# EAGLE design avr-net-pcb-rev.B (EAGLE 5.10)
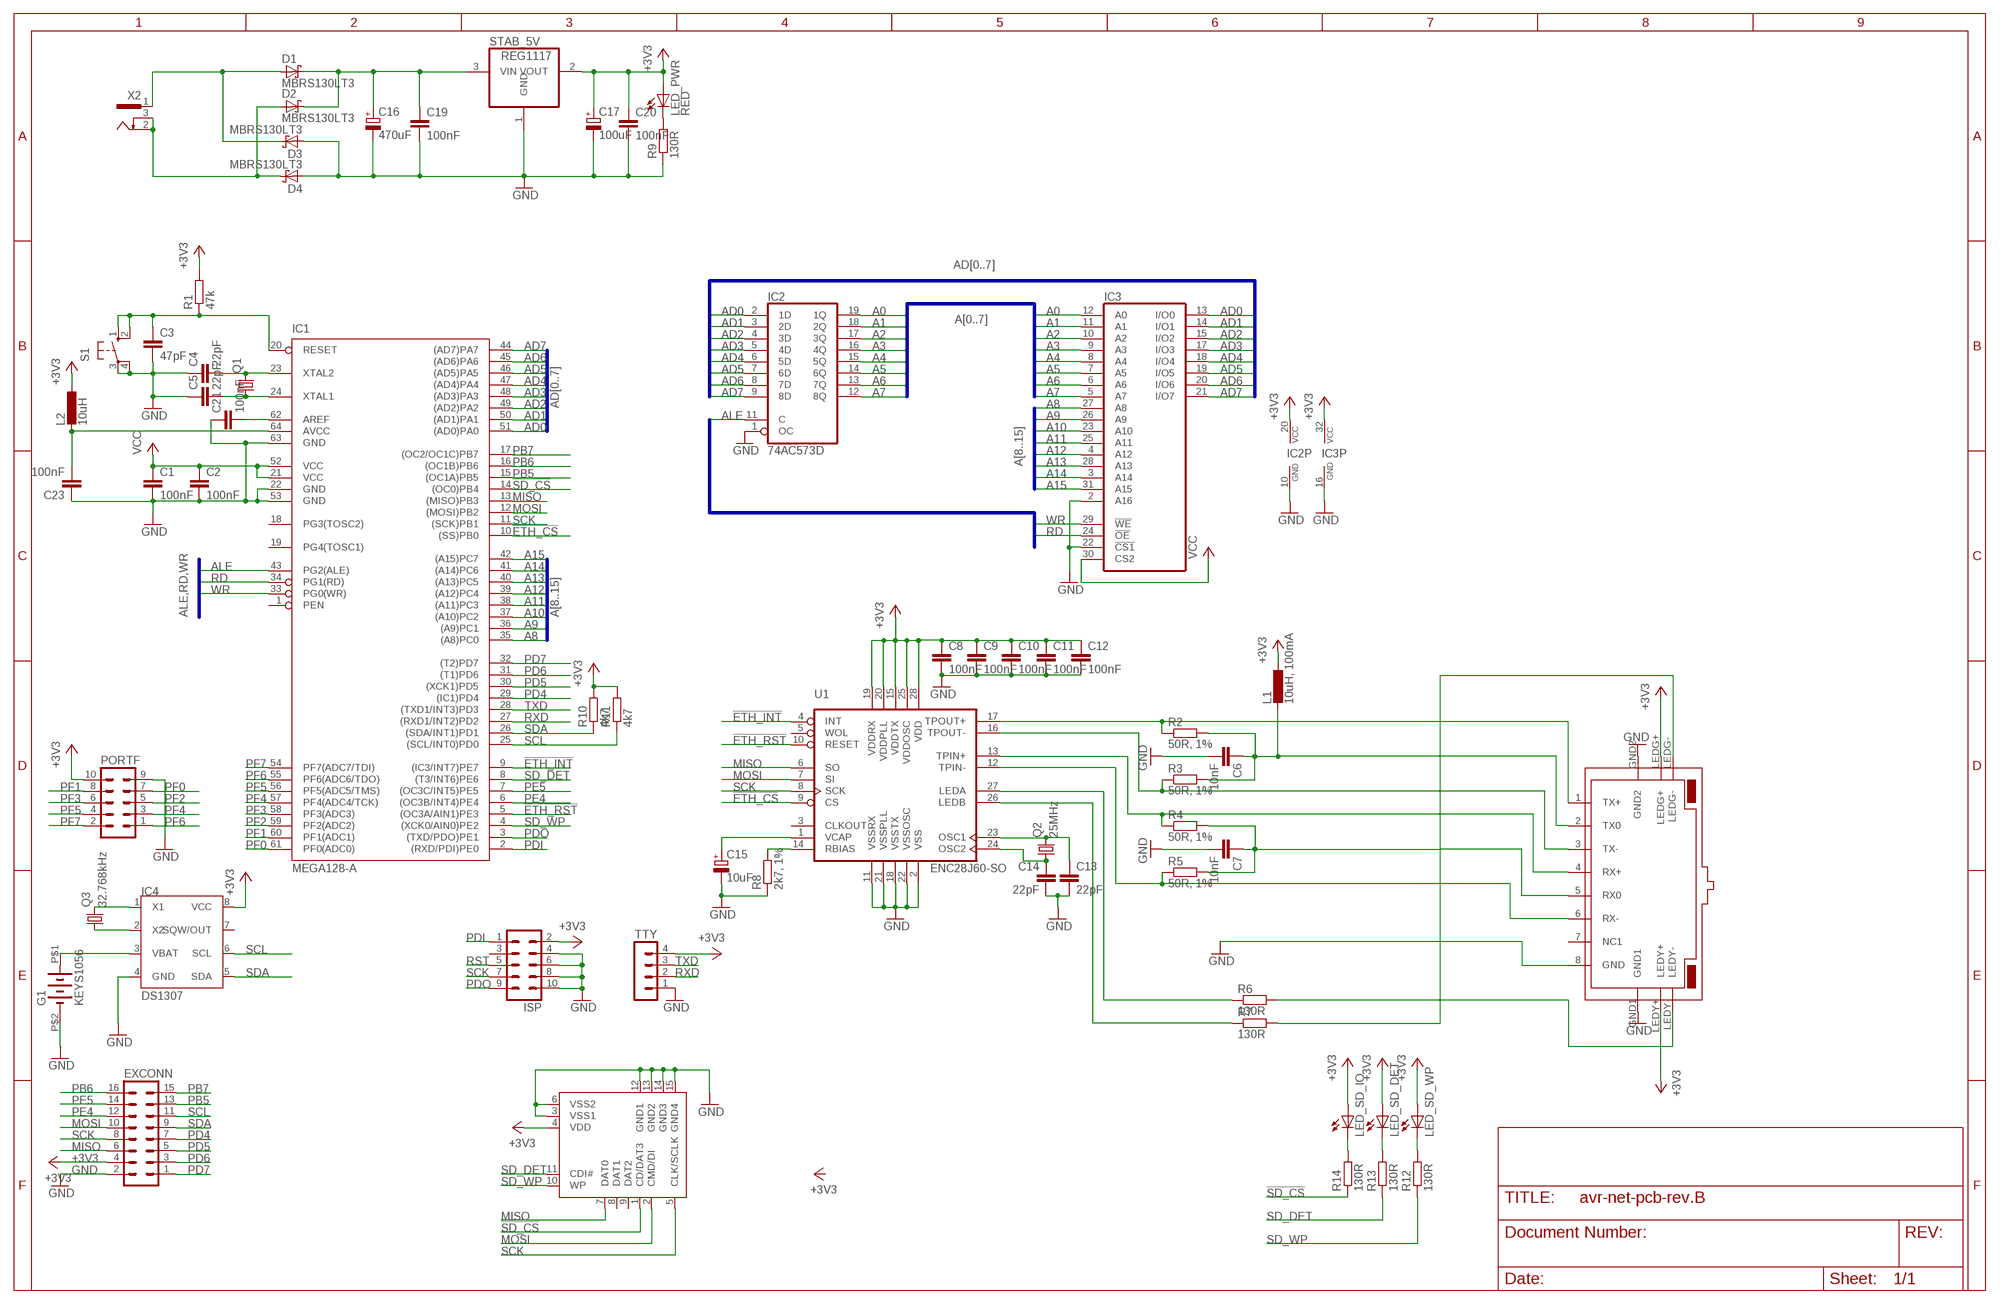
[diagram p0: schematic, sheet 1]

## Parts
C1  100nF  C-EUC0805  [C0805]
C2  100nF  C-EUC0805  [C0805]
C3  47pF  C-EUC0805  [C0805]
C4  22pF  C-EUC0805  [C0805]
C5  22pF  C-EUC0805  [C0805]
C6  10nF  C-EUC0805  [C0805]
C7  10nF  C-EUC0805  [C0805]
C8  100nF  C-EUC0805  [C0805]
C9  100nF  C-EUC0805  [C0805]
C10  100nF  C-EUC0805  [C0805]
C11  100nF  C-EUC0805  [C0805]
C12  100nF  C-EUC0805  [C0805]
C13  22pF  C-EUC0805  [C0805]
C14  22pF  C-EUC0805  [C0805]
C15  10uF  CPOL-EU153CLV-0505  [153CLV-0505]
C16  470uF  CPOL-EU153CLV-0810  [153CLV-0810]
C17  100uF  CPOL-EU153CLV-0810  [153CLV-0810]
C19  100nF  C-EUC0805  [C0805]
C20  100nF  C-EUC0805  [C0805]
C21  100nF  C-EUC0805  [C0805]
C23  100nF  C-EUC0805  [C0805]
D1  MBRS130LT3  [SMB]
D2  MBRS130LT3  [SMB]
D3  MBRS130LT3  [SMB]
D4  MBRS130LT3  [SMB]
EXCONN  MA08-2  [MA08-2]
G1  KEYS1056  [CR1220]
IC1  MEGA128-A  [TQFP64]
IC2  74AC573D  [SO20W]
IC3  LP621024CM  [SOP32L]
IC4  DS1307  [SOIC-8]
ISP  ML10  [ML10]
L1  10uH, 100mA  L-EUL1210W  [L1210W]
L2  10uH  L-EUL1210W  [L1210W]
LED_PWR  RED  LEDCHIPLED_1206  [CHIPLED_1206]
LED_SD_DET  LEDCHIPLED_1206  [CHIPLED_1206]
LED_SD_IO  LEDCHIPLED_1206  [CHIPLED_1206]
LED_SD_WP  LEDCHIPLED_1206  [CHIPLED_1206]
PORTF  MA05-2  [MA05-2]
Q1  CRYSTALHC49UP  [HC49UP]
Q2  25MHz  CRYSTALHC49UP  [HC49UP]
Q3  32.768kHz  91SMX  [91SMX]
R1  47k  R-EU_R0805  [R0805]
R2  50R, 1%  R-EU_R0805  [R0805]
R3  50R, 1%  R-EU_R0805  [R0805]
R4  50R, 1%  R-EU_R0805  [R0805]
R5  50R, 1%  R-EU_R0805  [R0805]
R6  130R  R-EU_R0805  [R0805]
R7  130R  R-EU_R0805  [R0805]
R8  2k7, 1%  R-EU_M0805  [M0805]
R9  130R  R-EU_R0805  [R0805]
R10  4k7  R-EU_R0805  [R0805]
R11  4k7  R-EU_R0805  [R0805]
R12  130R  R-EU_R0805  [R0805]
R13  130R  R-EU_R0805  [R0805]
R14  130R  R-EU_R0805  [R0805]
S1  10-XX  [B3F-10XX]
STAB_5V  REG1117  [SOT223]
TTY  MA04-1  [MA04-1]
U1  ENC28J60-SO  [SO28W]
U$1  RJ45-TRAFO-L  [RJ45-TRAFO-L]
U$2  SDCARDVAR2  [SDCMF-10915W010]
X2  SCD-014A  [SCD-014-A]

## Nets
!ETH_CS: IC1.10((SS)PB0) U1.9(CS)
!ETH_INT: IC1.9((IC3/INT7)PE7) U1.4(INT)
!ETH_RST: IC1.5((OC3A/AIN1)PE3) U1.10(RESET)
!SD_CS: IC1.14((OC0)PB4) R14.1 U$2.1(CD/DAT3)
+3V3: C1.1 C2.1 C8.1 C9.1 C10.1 C11.1 C12.1 C17.+ C20.1 EXCONN.4 IC1.21(VCC) IC1.52(VCC) IC2.20(VCC) IC3.30(CS2) IC3.32(VCC) IC4.8(VCC) ISP.2 L1.1 L2.1 LED_PWR.A LED_SD_DET.A LED_SD_IO.A LED_SD_WP.A PORTF.10 R1.2 R10.2 R11.2 STAB_5V.2(VOUT) TTY.4 U1.15(VDDTX) U1.19(VDDRX) U1.20(VDDPLL) U1.25(VDDOSC) U1.28(VDD) U$1.LEDG+ U$1.LEDY+ U$2.4(VDD) ; supply symbol labelled VCC
A0: IC2.19(1Q) IC3.12(A0)
A1: IC2.18(2Q) IC3.11(A1)
A2: IC2.17(3Q) IC3.10(A2)
A3: IC2.16(4Q) IC3.9(A3)
A4: IC2.15(5Q) IC3.8(A4)
A5: IC2.14(6Q) IC3.7(A5)
A6: IC2.13(7Q) IC3.6(A6)
A7: IC2.12(8Q) IC3.5(A7)
A8: IC1.35((A8)PC0) IC3.27(A8)
A9: IC1.36((A9)PC1) IC3.26(A9)
A10: IC1.37((A10)PC2) IC3.23(A10)
A11: IC1.38((A11)PC3) IC3.25(A11)
A12: IC1.39((A12)PC4) IC3.4(A12)
A13: IC1.40((A13)PC5) IC3.28(A13)
A14: IC1.41((A14)PC6) IC3.3(A14)
A15: IC1.42((A15)PC7) IC3.31(A15)
AD0: IC1.51((AD0)PA0) IC2.2(1D) IC3.13(I/O0)
AD1: IC1.50((AD1)PA1) IC2.3(2D) IC3.14(I/O1)
AD2: IC1.49((AD2)PA2) IC2.4(3D) IC3.15(I/O2)
AD3: IC1.48((AD3)PA3) IC2.5(4D) IC3.17(I/O3)
AD4: IC1.47((AD4)PA4) IC2.6(5D) IC3.18(I/O4)
AD5: IC1.46((AD5)PA5) IC2.7(6D) IC3.19(I/O5)
AD6: IC1.45((AD6)PA6) IC2.8(7D) IC3.20(I/O6)
AD7: IC1.44((AD7)PA7) IC2.9(8D) IC3.21(I/O7)
ALE: IC1.43(PG2(ALE)) IC2.11(C)
GND: C1.2 C2.2 C3.2 C4.1 C5.1 C6.2 C7.2 C8.2 C9.2 C10.2 C11.2 C12.2 C13.2 C14.2 C15.- C16.- C17.- C19.2 C20.2 C21.1 C23.1 D3.A D4.A EXCONN.2 G1.P$2(-) IC1.22(GND) IC1.53(GND) IC1.63(GND) IC2.1(OC) IC2.10(GND) IC3.2(A16) IC3.16(GND) IC3.22(!CS1) IC4.4(GND) ISP.4 ISP.6 ISP.8 ISP.10 PORTF.9 R8.1 R9.1 S1.3(P) S1.4(P1) STAB_5V.1(GND) TTY.1 U1.2(VSS) U1.11(VSSRX) U1.18(VSSTX) U1.21(VSSPLL) U1.22(VSSOSC) U$1.8(GND) U$1.GND1 U$1.GND2 U$2.3(VSS1) U$2.6(VSS2) U$2.12(GND1) U$2.13(GND2) U$2.14(GND3) U$2.15(GND4)
MISO: EXCONN.6 IC1.13((MISO)PB3) U1.6(SO) U$2.7(DAT0)
MOSI: EXCONN.10 IC1.12((MOSI)PB2) U1.7(SI) U$2.2(CMD/DI)
N$1: C4.2 IC1.23(XTAL2) Q1.2
N$2: C5.2 IC1.24(XTAL1) Q1.1
N$3: R7.2 U$1.LEDG-
N$4: C6.1 L1.2 R2.2 R3.2 U$1.2(TX0)
N$5: R2.1 U1.17(TPOUT+) U$1.1(TX+)
N$6: R3.1 U1.16(TPOUT-) U$1.3(TX-)
N$7: R4.1 U1.13(TPIN+) U$1.4(RX+)
N$8: R5.1 U1.12(TPIN-) U$1.6(RX-)
N$9: C7.1 R4.2 R5.2 U$1.5(RX0)
N$10: R6.1 U1.27(LEDA)
N$11: R7.1 U1.26(LEDB)
N$12: R6.2 U$1.LEDY-
N$13: G1.P$1(+) IC4.3(VBAT)
N$14: IC4.1(X1) Q3.2
N$15: IC4.2(X2) Q3.1
N$16: C13.1 Q2.2 U1.23(OSC1)
N$17: C14.1 Q2.1 U1.24(OSC2)
N$18: LED_SD_WP.C R12.2
N$19: LED_SD_DET.C R13.2
N$20: R8.2 U1.14(RBIAS)
N$21: C15.+ U1.1(VCAP)
N$22: LED_SD_IO.C R14.2
N$31: D1.A D3.C X2.1
N$32: C21.2 IC1.62(AREF)
N$33: D2.A D4.C X2.2 X2.3
N$34: C16.+ C19.1 D1.C D2.C STAB_5V.3(VIN)
N$35: C23.2 IC1.64(AVCC) L2.2
N$36: LED_PWR.C R9.2
PB5: EXCONN.13 IC1.15((OC1A)PB5)
PB6: EXCONN.16 IC1.16((OC1B)PB6)
PB7: EXCONN.15 IC1.17((OC2/OC1C)PB7)
PD4: EXCONN.7 IC1.29((IC1)PD4)
PD5: EXCONN.5 IC1.30((XCK1)PD5)
PD6: EXCONN.3 IC1.31((T1)PD6)
PD7: EXCONN.1 IC1.32((T2)PD7)
PDI: IC1.2((RXD/PDI)PE0) ISP.1
PDO: IC1.3((TXD/PDO)PE1) ISP.9
PE4: EXCONN.12 IC1.6((OC3B/INT4)PE4)
PE5: EXCONN.14 IC1.7((OC3C/INT5)PE5)
PF0: IC1.61(PF0(ADC0)) PORTF.7
PF1: IC1.60(PF1(ADC1)) PORTF.8
PF2: IC1.59(PF2(ADC2)) PORTF.5
PF3: IC1.58(PF3(ADC3)) PORTF.6
PF4: IC1.57(PF4(ADC4/TCK)) PORTF.3
PF5: IC1.56(PF5(ADC5/TMS)) PORTF.4
PF6: IC1.55(PF6(ADC6/TDO)) PORTF.1
PF7: IC1.54(PF7(ADC7/TDI)) PORTF.2
RD: IC1.34(PG1(RD)) IC3.24(!OE)
RST: C3.1 IC1.20(RESET) ISP.5 R1.1 S1.1(S) S1.2(S1)
RXD: IC1.27((RXD1/INT2)PD2) TTY.2
SCK: EXCONN.8 IC1.11((SCK)PB1) ISP.7 U1.8(SCK) U$2.5(CLK/SCLK)
SCL: EXCONN.11 IC1.25((SCL/INT0)PD0) IC4.6(SCL) R11.1
SD_DET: IC1.8((T3/INT6)PE6) R13.1 U$2.11(CDI#)
SD_WP: IC1.4((XCK0/AIN0)PE2) R12.1 U$2.10(WP)
SDA: EXCONN.9 IC1.26((SDA/INT1)PD1) IC4.5(SDA) R10.1
TXD: IC1.28((TXD1/INT3)PD3) TTY.3
WR: IC1.33(PG0(WR)) IC3.29(!WE)
Unconnected: IC1.1(PEN) IC1.18(PG3(TOSC2)) IC1.19(PG4(TOSC1)) IC3.1(NC) IC4.7(SQW/OUT) ISP.3 U1.3(CLKOUT) U1.5(WOL) U$1.7(NC1) U$2.8(DAT1) U$2.9(DAT2)

## Buses
ALE,RD,WR
AD[0..7]
A[8..15]
A[0..7]

## Library data of the parts
C1-C14 C19-C21 C23 = rcl:C-EU: CAPACITOR, European symbol
C15-C17 = rcl:CPOL-EU: POLARIZED CAPACITOR, European symbol
D1-D4 = diode:MBRS130LT3: Schottky Power Rectifier Source: http://www.onsemi.com/pub/Collateral/MBRS130LT3-D.PDF
EXCONN = con-lstb:MA08-2: PIN HEADER
G1 = keystone-bat:KEYS1056
IC1 = atmel:MEGA128: MICROCONTROLLER 128 Kbytes FLASH 4 Kbytes SRAM 4 Kbytes EEPROM DUAL USART 8-channel 10 bit ADC Source: avr.lbr
IC2 = 74xx-eu:74*573: 8-bit D latch BUS DRIVER
IC3 = memory:LP621024CM: MEMORY
IC4 = dallas:DS1307: I2C Serial RTC w/56 bytes battery backed RAM
ISP = con-harting-ml:ML10: HARTING
L1 L2 = rcl-2:L-EU: INDUCTOR, European symbol
LED_PWR LED_SD_DET LED_SD_IO LED_SD_WP = led:LED: LED OSRAM: - CHIPLED LG R971, LG N971, LY N971, LG Q971, LY Q971, LO R971, LY R971 LH N974, LH R974 LS Q976, LO Q976, LY Q976 LO Q996 - Hyper CHIPLED LW Q18S LB Q993, LB Q99A, LB R99A - SideLED LS A670, LO A670, LY A670, LG A670, LP A670 LB A673, LV A673, LT A673, LW A673 LH A674 LY A675 LS A676, LA A676, LO A676, LY A676, LW A676 LS A679, LY A679, LG A679 - Hyper Micro SIDELED® LS Y876, LA Y876, LO Y876, LY Y876 LT Y87S - SmartLED LW L88C, LW L88S LB L89C, LB L89S, LG L890 LS L89K, LO L89K, LY L89K LS L896, LA L896, LO L896, LY L896 - TOPLED LS T670, LO T670, LY T670, LG T670, LP T670 LSG T670, LSP T670, LSY T670, LOP T670, LYG T670 LG T671, LOG T671, LSG T671 LB T673, LV T673, LT T673, LW T673 LH T674 LS T676, LA T676, LO T676, LY T676, LB T676, LH T676, LSB T676, LW T676 LB T67C, LV T67C, LT T67C, LS T67K, LO T67K, LY T67K, LW E67C LS E67B, LA E67B, LO E67B, LY E67B, LB E67C, LV E67C, LT E67C LW T67C LS T679, LY T679, LG T679 LS T770, LO T770, LY T770, LG T770, LP T770 LB T773, LV T773, LT T773, LW T773 LH T774 LS E675, LA E675, LY E675, LS T675 LS T776, LA T776, LO T776, LY T776, LB T776 LHGB T686 LT T68C, LB T68C - Hyper Mini TOPLED® LB M676 - Mini TOPLED Santana® LG M470 LS M47K, LO M47K, LY M47K Source: http://www.osram.convergy.de LUXEON: - LUMILED® LXK2-PW12-R00, LXK2-PW12-S00, LXK2-PW14-U00, LXK2-PW14-V00 LXK2-PM12-R00, LXK2-PM12-S00, LXK2-PM14-U00 LXK2-PE12-Q00, LXK2-PE12-R00, LXK2-PE12-S00, LXK2-PE14-T00, LXK2-PE14-U00 LXK2-PB12-K00, LXK2-PB12-L00, LXK2-PB12-M00, LXK2-PB14-N00, LXK2-PB14-P00, LXK2-PB14-Q00 LXK2-PR12-L00, LXK2-PR12-M00, LXK2-PR14-Q00, LXK2-PR14-R00 LXK2-PD12-Q00, LXK2-PD12-R00, LXK2-PD12-S00 LXK2-PH12-R00, LXK2-PH12-S00 LXK2-PL12-P00, LXK2-PL12-Q00, LXK2-PL12-R00 Source: www.luxeon.com KINGBRIGHT: KA-3528ASYC Source: www.kingbright.com
PORTF = con-lstb:MA05-2: PIN HEADER
Q1 Q2 = crystal:CRYSTAL: CRYSTAL
Q3 = my_crystal:91SMX
R1-R14 = rcl:R-EU_: RESISTOR, European symbol
S1 = switch-omron:10-XX: OMRON SWITCH
STAB_5V = burr-brown:REG1117: 800mA and 1A Low Dropout (LDO) Positive Regulator 1.8V, 2.5V, 2.85V, 3.3V, 5V, and Adj
TTY = con-lstb:MA04-1: PIN HEADER
U1 = microchip-enc28j60:ENC28J60-*: Microchip 10Mbit Eth. contoller with SPI interface
U$1 = con-amphenol-rj45-ld:RJ45-TRAFO-L: RJ45 socket with integrated magnetics and LEDs Naming: Amphenol LMJ1998824110DL1T39J TME RJ45-TRAFO-L Author: Petr Kalandra <mailto:kalandrap@gmail.com> Datasheet: http://zefiryn.tme.pl/dok/zlacza/rjtrafol.PDF
U$2 = kingfont_sdcmf10915w010_covek:SDCARD: SD card connector KINGFONT SDCMF-10915W010
X2 = con-shiua-chyuan:SCD-014A: Power Jack 2.5mm

## Net classes
0 default: width 0.305 mm, drill 0.305 mm, clearance 0.305 mm
1 PWR: width 0.406 mm, drill 0.406 mm, clearance 0.406 mm

## Board
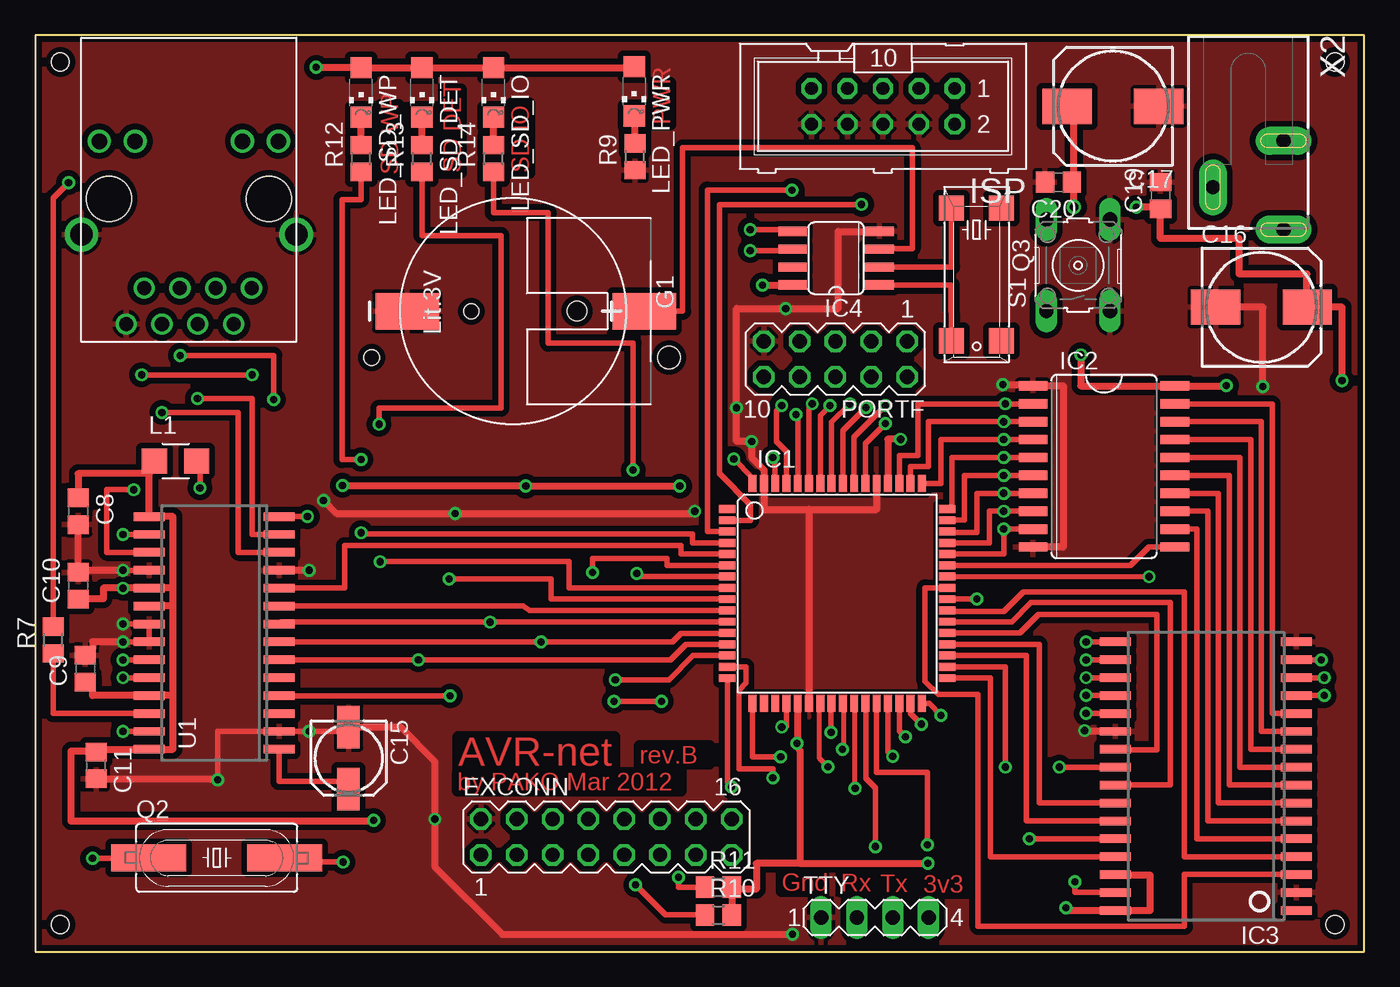
[diagram p1: board, top side]
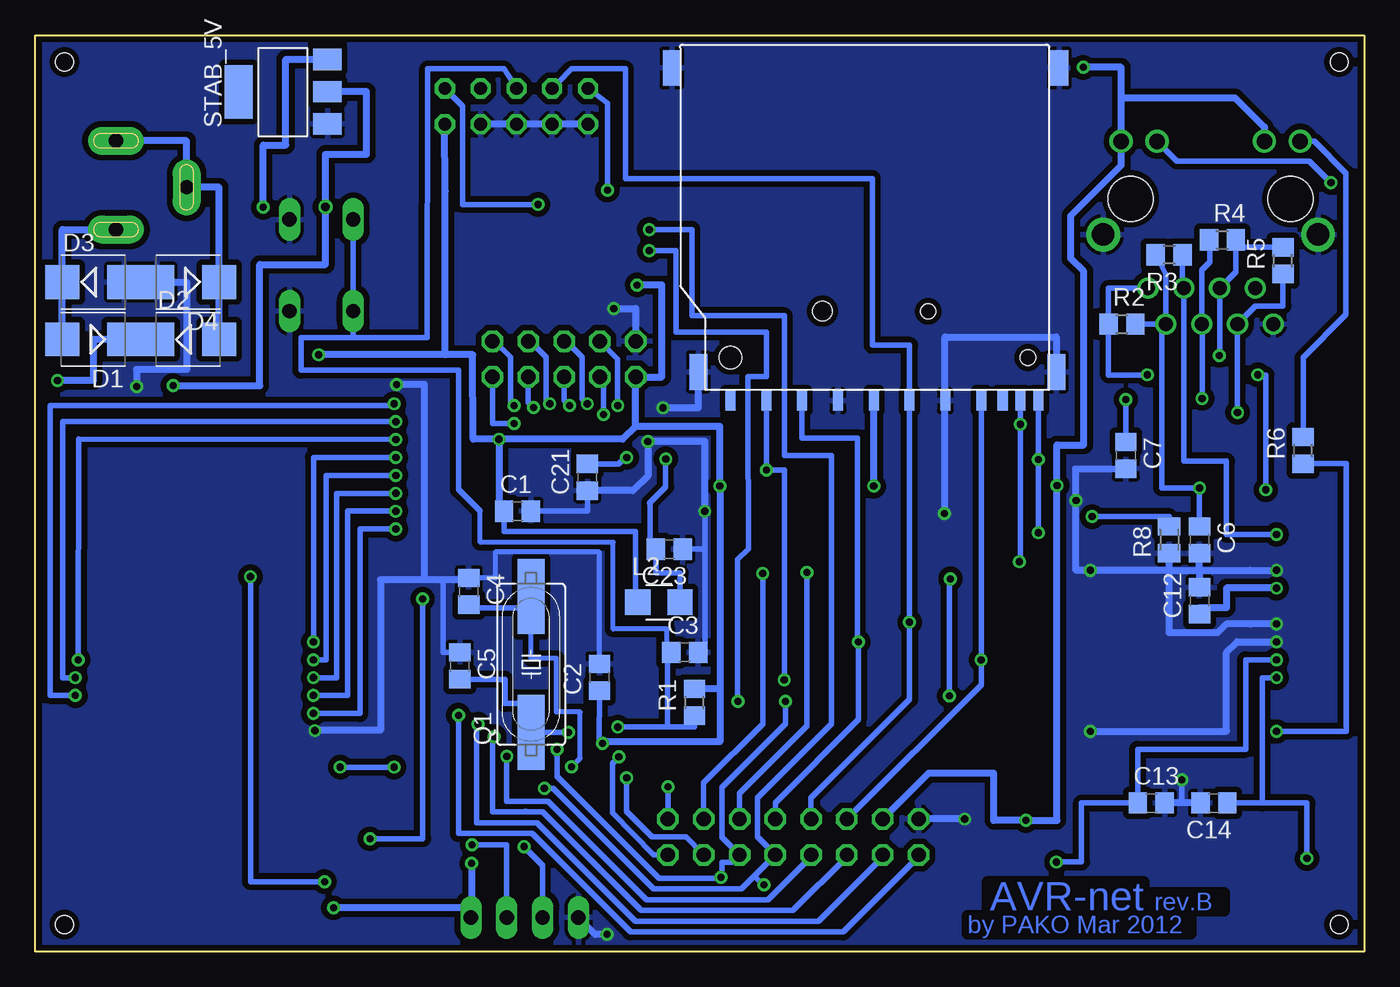
[diagram p2: board, bottom side, seen from below]

Size 94.28 x 65.01 mm. Coordinates in mm from the lower left corner, seen from the top.
Outline: 0,0 94.28,0 94.28,65.01 0,65.01 0,0
Copper layers (1*16): Top 0.035mm / dielectric 1.5mm / Bottom 0.035mm
Design rules "default *": minimum track width 10mil, minimum drill 20mil, track to track 8mil, track to pad 8mil, pad to pad 8mil, via to via 8mil, smd to smd 8mil, copper to edge 5mil, drill to drill 8mil, minimum pad ring 10mil, minimum via ring 8mil, stop-mask expansion 4mil, vias tented up to drill 0mil, thermal gap 10mil
Holes 1.27 mm at 92.2,63.12 1.78,63.12 1.78,1.91 92.2,1.91

### Footprints (pad centres in the part's own frame; a part is rotated, then mirrored left to right if it is on the bottom)
C0805 = smd 1.3 x 1.5: 1 -0.95,0; 2 0.95,0
153CLV-0505 = smd 3 x 1.6: + 2.2,0; - -2.2,0
153CLV-0810 = smd 3.5 x 2.5: + 3.25,0; - -3.25,0
SMB = smd 2.4 x 2.4: A 2.2,0; C -2.2,0
MA08-2 = drill 1.016 octagon: 1 -8.89,-1.27; 2 -8.89,1.27; 3 -6.35,-1.27; 4 -6.35,1.27; 5 -3.81,-1.27; 6 -3.81,1.27; 7 -1.27,-1.27; 8 -1.27,1.27; 9 1.27,-1.27; 10 1.27,1.27; 11 3.81,-1.27; 12 3.81,1.27; 13 6.35,-1.27; 14 6.35,1.27; 15 8.89,-1.27; 16 8.89,1.27
CR1220 = smd 2.6 x 4.5: P$1 0,9.3; P$2 0,-7.5 | hole 1.07: 0,-2.96 | hole 1.4: 0,4.54
TQFP64 = smd 1.194 x 0.559: 1 -7.8,6; 2 -7.8,5.2; 3 -7.8,4.4; 4 -7.8,3.6; 5 -7.8,2.8; 6 -7.8,2; 7 -7.8,1.2; 8 -7.8,0.4; 9 -7.8,-0.4; 10 -7.8,-1.2; 11 -7.8,-2; 12 -7.8,-2.8; 13 -7.8,-3.6; 14 -7.8,-4.4; 15 -7.8,-5.2; 16 -7.8,-6; 33 7.8,-6; 34 7.8,-5.2; 35 7.8,-4.4; 36 7.8,-3.6; 37 7.8,-2.8; 38 7.8,-2; 39 7.8,-1.2; 40 7.8,-0.4; 41 7.8,0.4; 42 7.8,1.2; 43 7.8,2; 44 7.8,2.8; 45 7.8,3.6; 46 7.8,4.4; 47 7.8,5.2; 48 7.8,6 | smd 0.559 x 1.194: 17 -6,-7.8; 18 -5.2,-7.8; 19 -4.4,-7.8; 20 -3.6,-7.8; 21 -2.8,-7.8; 22 -2,-7.8; 23 -1.2,-7.8; 24 -0.4,-7.8; 25 0.4,-7.8; 26 1.2,-7.8; 27 2,-7.8; 28 2.8,-7.8; 29 3.6,-7.8; 30 4.4,-7.8; 31 5.2,-7.8; 32 6,-7.8; 49 6,7.8; 50 5.2,7.8; 51 4.4,7.8; 52 3.6,7.8; 53 2.8,7.8; 54 2,7.8; 55 1.2,7.8; 56 0.4,7.8; 57 -0.4,7.8; 58 -1.2,7.8; 59 -2,7.8; 60 -2.8,7.8; 61 -3.6,7.8; 62 -4.4,7.8; 63 -5.2,7.8; 64 -6,7.8
SO20W = smd 0.66 x 2.032: 1 -5.715,-5.029; 2 -4.445,-5.029; 3 -3.175,-5.029; 4 -1.905,-5.029; 5 -0.635,-5.029; 6 0.635,-5.029; 7 1.905,-5.029; 8 3.175,-5.029; 9 4.445,-5.029; 10 5.715,-5.029; 11 5.715,5.029; 12 4.445,5.029; 13 3.175,5.029; 14 1.905,5.029; 15 0.635,5.029; 16 -0.635,5.029; 17 -1.905,5.029; 18 -3.175,5.029; 19 -4.445,5.029; 20 -5.715,5.029
SOP32L = smd 0.6 x 2.2: 1 -9.525,-6.416; 2 -8.255,-6.416; 3 -6.985,-6.416; 4 -5.715,-6.416; 5 -4.445,-6.416; 6 -3.175,-6.416; 7 -1.905,-6.416; 8 -0.635,-6.416; 9 0.635,-6.416; 10 1.905,-6.416; 11 3.175,-6.416; 12 4.445,-6.416; 13 5.715,-6.416; 14 6.985,-6.416; 15 8.255,-6.416; 16 9.525,-6.416; 17 9.525,6.416; 18 8.255,6.416; 19 6.985,6.416; 20 5.715,6.416; 21 4.445,6.416; 22 3.175,6.416; 23 1.905,6.416; 24 0.635,6.416; 25 -0.635,6.416; 26 -1.905,6.416; 27 -3.175,6.416; 28 -4.445,6.416; 29 -5.715,6.416; 30 -6.985,6.416; 31 -8.255,6.416; 32 -9.525,6.416
SOIC-8 = smd 2.032 x 0.66: 1 -3.073,1.27; 2 -3.073,0; 3 -3.073,-1.27; 4 -3.073,-2.54; 5 3.073,-2.54; 6 3.073,-1.27; 7 3.073,0; 8 3.073,1.27
ML10 = drill 0.914 octagon: 1 -5.08,-1.27; 2 -5.08,1.27; 3 -2.54,-1.27; 4 -2.54,1.27; 5 0,-1.27; 6 0,1.27; 7 2.54,-1.27; 8 2.54,1.27; 9 5.08,-1.27; 10 5.08,1.27
L1210W = smd 1.8 x 1.8: 1 -1.499,0; 2 1.499,0
CHIPLED_1206 = smd 1.5 x 1.5: A 0,-1.75; C 0,1.75
MA05-2 = drill 1.016 octagon: 1 -5.08,-1.27; 2 -5.08,1.27; 3 -2.54,-1.27; 4 -2.54,1.27; 5 0,-1.27; 6 0,1.27; 7 2.54,-1.27; 8 2.54,1.27; 9 5.08,-1.27; 10 5.08,1.27
HC49UP = smd 5.334 x 1.93: 1 -4.826,0; 2 4.826,0
91SMX = smd 1.778 x 1.778: 1 -4.699,-1.778; 2 4.699,-1.778; 3 4.699,1.778; 4 -4.699,1.778
R0805 = smd 1.3 x 1.5: 1 -0.95,0; 2 0.95,0
M0805 = smd 1.3 x 1.6: 1 -0.95,0; 2 0.95,0
B3F-10XX = drill 1.016 long: 1 -3.251,2.261; 2 3.251,2.261; 3 -3.251,-2.261; 4 3.251,-2.261
SOT223 = smd 1.499 x 2.007: 1 -2.261,-3.15; 2 0.025,-3.15; 3 2.311,-3.15 | smd 3.81 x 2.007: 4 0,3.15
MA04-1 = drill 1.016 long: 1 -3.81,0; 2 -1.27,0; 3 1.27,0; 4 3.81,0
SO28W = smd 0.6 x 2.2: 1 -8.255,-4.6; 2 -6.985,-4.6; 3 -5.715,-4.6; 4 -4.445,-4.6; 5 -3.175,-4.6; 6 -1.905,-4.6; 7 -0.635,-4.6; 8 0.635,-4.6; 9 1.905,-4.6; 10 3.175,-4.6; 11 4.445,-4.6; 12 5.715,-4.6; 13 6.985,-4.6; 14 8.255,-4.6; 15 8.255,4.6; 16 6.985,4.6; 17 5.715,4.6; 18 4.445,4.6; 19 3.175,4.6; 20 1.905,4.6; 21 0.635,4.6; 22 -0.635,4.6; 23 -1.905,4.6; 24 -3.175,4.6; 25 -4.445,4.6; 26 -5.715,4.6; 27 -6.985,4.6; 28 -8.255,4.6
RJ45-TRAFO-L = drill 1 round: 1 -4.445,6.35; 2 -3.175,8.89; 3 -1.905,6.35; 4 -0.635,8.89; 5 0.635,6.35; 6 1.905,8.89; 7 3.175,6.35; 8 4.445,8.89 | drill 1.6 round: GND1 -7.62,2.54; GND2 7.62,2.54 | drill 1.1 round: LEDG+ -6.35,-4.08; LEDG- -3.81,-4.08; LEDY+ 3.81,-4.08; LEDY- 6.35,-4.08 | hole 3.2: -5.68,0; 5.68,0
SDCMF-10915W010 = smd 0.711 x 1.422: 1 7.366,13.462; 2 4.826,13.462; 3 2.286,13.462; 4 -0.254,13.462; 5 -2.794,13.462; 6 -5.334,13.462; 7 -7.874,13.462; 8 -9.398,13.462; 9 9.906,13.462; 10 -11.938,13.462; 11 -10.668,13.462 | smd 1.27 x 2.54: 12 12.192,11.43; 13 14.07,-10.14; 14 -13.408,-10.14; 15 -13.208,11.43 | hole 1.6: 9.906,10.414 | hole 1.1: -11.176,10.414
SCD-014-A = drill 1 pad 2 long: 1 -2.5,13.8; 2 -2.5,7.5; 3 2.5,10.8

### Placement (x,y rotation side)
C1  60.07,31.24 0 bottom
C2  54.25,19.46 90 bottom
C3  48.21,21.23 0 bottom
C4  63.53,25.55 270 bottom
C5  64.16,20.27 270 bottom
C6  11.68,29.21 270 bottom
C7  16.92,35.2 270 bottom
C8  3.05,31.24 270 top
C9  3.56,20.07 90 top
C10  3.05,25.96 90 top
C11  4.32,13.21 270 top
C12  11.68,24.89 90 bottom
C13  15.11,10.54 0 bottom
C14  10.67,10.54 180 bottom
C15  22.23,13.72 270 top
C16  87,45.72 0 top
C17  76.45,59.97 180 top
C19  79.83,53.64 90 top
C20  72.59,54.58 180 top
C21  55.12,33.66 90 bottom
C23  49.3,28.55 180 bottom
D1  90.17,43.43 180 bottom
D2  83.44,43.43 0 bottom
D3  90.17,47.5 0 bottom
D4  83.44,47.5 180 bottom
EXCONN  40.51,8.13 0 top
G1  33.89,45.43 270 top
IC1  56.9,25.4 0 top
IC2  75.82,34.42 270 top
IC3  83.06,12.45 90 top
IC4  56.82,48.56 180 top
ISP  60.15,59.97 180 top
L1  9.95,34.81 0 top
L2  50.04,24.78 0 bottom
LED_PWR  42.49,61.04 180 top
LED_SD_DET  27.43,60.96 180 top
LED_SD_IO  32.51,60.96 180 top
LED_SD_WP  23.11,60.96 180 top
PORTF  56.77,42.04 180 top
Q1  59.11,20.37 90 bottom
Q2  12.88,6.65 0 top
Q3  66.78,48.03 270 top
R1  47.52,17.68 90 bottom
R2  17.2,44.53 0 bottom
R3  13.84,49.43 180 bottom
R4  10.06,50.5 0 bottom
R5  5.77,49.02 90 bottom
R6  4.34,35.56 90 bottom
R7  1.27,22.1 90 top
R8  13.84,29.21 90 bottom
R9  42.55,56.39 90 top
R10  48.46,2.59 0 top
R11  48.46,4.57 0 top
R12  23.11,56.26 90 top
R13  27.43,56.26 90 top
R14  32.51,56.26 90 top
S1  73.99,48.69 90 top
STAB_5V  76.71,60.99 90 bottom
TTY  59.56,2.41 0 top
U1  12.7,22.61 90 top
U$1  10.9,53.42 180 top
U$2  35.05,52.55 180 bottom
X2  86.06,65.02 180 top

### Tracks (layer width: path | path; a pad name or v marks a point on that pad's centre or on a via)
!ETH_CS
  Top 0.406: U1.9 34.62,24.51 35.05,24.21 48.98,24.21 IC1.10
!ETH_INT  (via drill 0.51)
  Top 0.406: IC1.9 36.58,25 36.58,26.44 v29.36,26.44 | v29.44,18.14 17.3,18.14 U1.4
  Bottom 0.406: v29.36,26.44 29.44,26.44 v29.44,18.14
!ETH_RST
  Top 0.406: IC1.5 45.8,28.19 45.8,28.8 21.95,28.8 21.95,25.78 U1.10
!SD_CS  (via drill 0.51)
  Top 0.406: IC1.14 46.68,21 44.96,19.28 v41.15,19.28 | v42.42,34.16 42.42,43.16 36.4,43.16 36.4,52.43 32.51,52.43 R14.1
  Bottom 0.406: v41.15,19.28 41.15,34.16 v42.42,34.16 U$2.1
+3V3  (via drill 0.51, 0.6)
  Top 0.406: 8.1,34.16 L1.1 | 73.14,59.97 C17.+ | C20.1 73.69,54.59 v73.69,52.83
  Top 0.508: 9.78,24.51 9.78,25.78 | 9.78,24.51 U1.20 | 9.78,18.16 9.78,14.35 U1.28 4,14.35 C11.1 4.32,14.22 2.54,14.22 2.54,9.27 24,9.27 v24,9.3 | 9.78,18.16 U1.25 4.06,18.16 4.06,19.43 3.56,19.43 C9.1 | 9.78,18.16 9.78,24.51 | 9.78,25.78 U1.19 v6.22,25.78 4.83,25.78 4.83,25.02 C10.1 | 9.78,25.78 9.78,30.86 U1.15 | U1.15 8.1,34.16 | U1.15 8.1,33.91 3.05,33.91 C8.1 | v73.13,3.1 73.3,2.92 IC3.32 79.1,2.92 79.1,5.41 76.64,5.41 IC3.30 | v74.17,42.34 74.17,40.13 IC2.20 84.48,40.13 v84.51,40.16 | IC1.52 60.48,33.07 60.48,36.35 v61.39,36.35 | IC1.21 54.1,15.11 v54.05,14.76 54.25,14.25 54.25,6.25 | 54.25,6.25 v63.32,6.25 | v51.59,47.3 IC4.8 | R10.2 R11.2 arc90 49.57,4.42 51.16,4.42 51.16,6.25 54.25,6.25 | C17.+ 73.2,59.74 | LED_PWR.A 42.42,62.71 LED_SD_IO.A LED_SD_DET.A LED_SD_WP.A 23.09,62.74 v19.94,62.74 | v21.79,33.07 34.8,33.07 v34.8,33.02 v45.72,33.02 | 73.14,59.97 73.69,59.97 v73.69,52.83
  Bottom 0.406: 61.02,31.37 60.88,31.37 | L2.1 51.71,24.96 51.71,29.79 60.5,29.79 60.51,29.8 61.02,29.8 C1.1 61.02,31.37 | v54.05,14.76 54.28,14.76 C2.1 | 61.19,31.37 61.02,31.37
  Bottom 0.508: C12.1 11.68,24.38 9.78,24.38 9.78,25.78 v6.22,25.78 | 65.2,42.34 63.25,42.34 63.22,36.35 v61.39,36.35 | v54.05,14.76 54.1,14.88 45.72,14.88 45.72,18.63 | C1.1 60.88,31.24 | 61.19,31.37 61.39,31.37 v61.39,36.35 | ISP.2 65.2,53.98 65.2,42.34 | 63.37,3.1 TTY.4 | 63.37,3.1 v73.13,3.1 | 63.37,3.1 63.32,3.1 v63.32,6.25 | EXCONN.4 30.91,12.65 26.29,12.65 26.29,9.3 v24,9.3 21.79,9.3 v21.79,33.07 21.79,35.94 19.9,35.94 19.9,48.27 20.83,49.17 20.83,52.2 17.25,55.78 U$1.LEDG+ 17.25,60.58 | v51.59,47.3 49.84,47.3 49.84,40.77 PORTF.10 51.69,37.26 | STAB_5V.2 70.79,61.01 70.79,56.57 73.69,56.57 v73.69,52.83 73.69,48.74 78.36,48.74 78.36,40.16 v84.51,40.16 | 17.25,60.58 17.25,62.74 v19.94,62.74 | 17.25,60.58 9.17,60.58 7.09,58.5 U$1.LEDY+ | v34.8,33.02 U$2.4 | 45.72,18.63 v45.72,33.02 45.72,37.26 51.69,37.26 | 45.72,18.63 R1.2 | 65.2,42.34 v74.17,42.34 | v61.39,36.35 52.6,36.35 51.69,37.26
A0
  Top 0.406: IC2.19 87.76,38.86 87.76,16.89 IC3.12
A1
  Top 0.406: IC2.18 87,37.59 87,15.62 IC3.11
A2
  Top 0.406: IC2.17 86.23,36.32 86.23,14.35 IC3.10
A3
  Top 0.406: IC2.16 85.47,35.05 85.47,13.08 IC3.9
A4
  Top 0.406: IC2.15 84.71,33.78 84.71,11.81 IC3.8
A5
  Top 0.406: IC2.14 83.95,32.51 83.95,10.54 IC3.7
A6
  Top 0.406: IC2.13 83.19,31.24 83.19,9.27 IC3.6
A7
  Top 0.406: IC2.12 82.42,29.97 82.42,8 IC3.5
A8
  Top 0.406: IC1.35 70.31,21 70.31,9.27 IC3.27
A9
  Top 0.406: IC1.36 71.22,21.8 71.22,10.54 IC3.26
A10
  Top 0.406: IC1.37 69.84,22.6 71.17,23.93 79.55,23.93 79.55,14.33 76.64,14.33 IC3.23
A11
  Top 0.406: IC3.25 80.54,11.81 80.54,24.77 70.64,24.77 69.27,23.4 IC1.38
A12
  Top 0.406: IC3.4 81.53,6.73 81.53,25.53 70.1,25.53 68.71,24.13 64.82,24.13 64.7,24.26 IC1.39
A13  (via drill 0.51)
  Top 0.406: v70.54,8 IC3.28 | v66.8,25.02 64.7,25.02 IC1.40
  Bottom 0.406: v70.54,8 66.8,8 v66.8,25.02
A14
  Top 0.406: IC1.41 63.12,25.8 63.12,19.18 64.06,18.24 66.88,18.24 66.88,1.78 81.53,1.78 81.53,5.46 IC3.3
A15  (via drill 0.51)
  Top 0.406: 64.7,26.67 IC1.42 v79.02,26.59 | v73.76,4.95 73.76,4.19 IC3.31
  Bottom 0.406: v79.02,26.59 79.02,4.95 v73.76,4.95
AD0  (via drill 0.51)
  Top 0.406: v91.44,18.16 IC3.13 | IC2.2 v68.83,38.86 62.61,38.86 62.61,35.18 61.3,35.18 IC1.51
  Bottom 0.406: v91.44,18.16 93.22,18.16 93.22,38.73 68.83,38.73 v68.83,38.86
AD1  (via drill 0.51)
  Top 0.406: v91.44,19.43 IC3.14 | IC2.3 v68.71,37.59 63.37,37.59 63.37,34.42 62.1,34.42 IC1.50
  Bottom 0.406: v91.44,19.43 92.33,19.43 92.33,37.59 v68.71,37.59
AD2  (via drill 0.51)
  Top 0.406: v91.24,20.7 IC3.15 | IC2.4 v68.71,36.32 64.26,36.32 64.26,33.2 IC1.49
  Bottom 0.406: v91.24,20.7 91.21,36.35 v68.71,36.32
AD3  (via drill 0.51)
  Top 0.406: v74.55,21.97 IC3.17 | IC2.5 v68.71,35.05 65.02,35.05 65.02,31.37 64.73,31.37 IC1.48
  Bottom 0.406: v74.55,21.97 74.55,35.05 v68.71,35.05
AD4  (via drill 0.51)
  Top 0.406: IC3.18 76.64,20.57 76.52,20.7 v74.55,20.7 | IC2.6 v68.71,33.78 65.91,33.78 65.91,30.61 IC1.47
  Bottom 0.406: v68.71,33.78 73.66,33.78 73.66,20.7 v74.55,20.7
AD5  (via drill 0.51)
  Top 0.406: v74.55,19.43 IC3.19 | IC2.7 v68.71,32.51 66.8,32.51 66.8,29.72 64.78,29.72 IC1.46
  Bottom 0.406: v74.55,19.43 72.9,19.43 72.9,32.51 v68.71,32.51
AD6  (via drill 0.51)
  Top 0.406: 71.37,31.24 IC2.8 v68.71,31.24 67.69,31.24 67.69,29 IC1.45 | v74.55,18.16 IC3.20
  Bottom 0.406: v74.55,18.16 72.14,18.16 72.14,31.24 v68.71,31.24
AD7  (via drill 0.51)
  Top 0.406: v74.55,16.89 IC3.21 | IC2.9 v68.71,29.97 68.71,28.2 IC1.44
  Bottom 0.406: v74.55,16.89 71.25,16.89 71.25,29.97 v68.71,29.97
ALE
  Top 0.406: 64.7,27.43 IC1.43 77.69,27.4 78.99,28.7 IC2.11
GND  (via drill 0.51)
  Top 0.305: C15.- 22.35,15.75
  Top 0.406: U1.2 v19.43,15.62 22.23,15.62 C15.- | v6.22,27.05 U1.18 | U1.2 17.3,15.49 | v6.22,23.24 U1.21 U1.22 v6.22,21.97 | v12.95,12.19 12.95,15.62 U1.2
  Top 0.508: v19.43,27.05 U1.11 | C11.2 12.89,12.26 v12.95,12.19 | v74.45,15.67 76.64,15.67 IC3.22 | 51.7,34.18 IC1.63 51.71,33.2 | 51.7,34.18 50.83,35.05 v50.83,36.2 49.76,36.2 v49.76,38.58 49.76,45.62 v53.24,45.62 56.97,45.62 56.97,51.08 59.97,51.08 IC4.4 | v46.79,31.24 46.79,31.09 v29.79,31.09 21.36,31.09 v20.45,32 | v53.72,1.22 33.15,1.22 28.35,6.02 v28.35,9.4 28.35,13.49 25.91,15.93 C15.- | C16.- 87.1,45.72 v87.1,40.08 | IC2.10 72.92,28.7 72.92,40.16 70.79,40.16 IC2.1 70.79,40.23 v68.66,40.23 | 54.9,31.37 IC1.22 | 51.71,33.2 51.71,31.37 54.9,31.37 | IC1.53 59.7,31.37 54.9,31.37 | 51.71,33.2 51.71,34.16 51.7,34.18 | v6.22,21.97 4.06,21.97 4.06,21.46 4,21.46 C9.2 | C8.2 C10.2 3.05,27.05 v6.22,27.05
  Bottom 0.305: 20.45,34.23 20.57,34.29
  Bottom 0.356: C2.2 54.25,28.35 61.65,28.35 61.65,26.5 C4.1
  Bottom 0.406: C14.2 12.95,10.54 v12.95,12.19 | v46.79,31.24 46.79,28.42 | C23.1 46.91,28.55 46.79,28.42 | C3.2 46.79,21.23 46.79,28.42 | C5.1 65.35,21.22 65.35,26.36 | C1.2 55.12,31.24 C21.1
  Bottom 0.508: C14.2 C13.2 | 13.84,27.05 R8.1 | 13.84,27.05 v19.43,27.05 20.45,27.05 v20.45,32 20.45,34.23 C7.2 | v6.22,27.05 U1.18 11.68,27.05 | 11.81,27.05 11.68,27.05 | 13.84,27.05 11.81,27.05 | v6.22,23.24 U1.21 9.78,23.24 10.41,22.61 13.84,22.61 13.84,27.05 | 11.68,27.05 C6.2 | v19.43,15.62 9.78,15.62 9.78,21.21 9.02,21.97 v6.22,21.97 | C12.2 11.68,26.92 11.81,27.05 | D4.A 85.72,47.5 | D3.A 87.97,47.75 87.06,47.75 87.06,47.5 D4.A | ISP.10 ISP.8 ISP.6 ISP.4 | 74.45,15.65 v74.45,15.67 74.45,15.7 69.8,15.7 69.8,26.36 66.67,26.36 | v46.79,31.24 46.79,36.2 v50.83,36.2 50.83,33.76 51.88,32.7 C21.1 | TTY.1 54.56,1.22 v53.72,1.22 | v28.35,9.4 EXCONN.2 | v53.24,45.62 51.69,45.62 PORTF.9 | v87.1,40.08 87.1,41.3 83.52,41.3 83.52,47.47 85.64,47.47 D4.A | 66.67,26.36 66.67,40.23 v68.66,40.23 | U$2.12 47.24,38.58 v49.76,38.58 | U$2.15 21.84,43.61 29.74,43.61 29.74,39.09 | 29.74,39.09 U$2.6 | 29.74,39.09 29.74,31.09 v29.79,31.09 | 66.67,26.36 65.35,26.36 63.52,26.36 C4.1
  pour Top (isolate 0.406): 0.3,0.3 93.95,0.3 93.95,2.21 93.95,64.69 92.89,64.69 0.3,64.69 0.3,63.63
  pour Bottom (isolate 0.406): 0.3,0.3 0.3,64.69 1.37,64.69 93.95,64.69 93.95,63.7 93.95,0.3 92.05,0.3
MISO  (via drill 0.51)
  Top 0.406: IC1.13 49.09,21.79 46.18,21.79 45.09,20.7 v27.18,20.7 U1.6
  Bottom 0.406: U$2.7 v27.18,20.7 27.18,18.92 EXCONN.6
MOSI  (via drill 0.51)
  Top 0.406: U1.7 v35.89,21.97 45.21,21.97 45.8,22.55 49.05,22.55 IC1.12
  Bottom 0.406: v35.89,21.97 35.74,22.12 | v35.89,21.97 35.89,16.46 41.78,10.57 EXCONN.10 41.76,9.42 | U$2.2 39.88,36.45 35.94,36.45 35.94,21.97 v35.89,21.97
N$1  (via drill 0.51)
  Top 0.356: v56.24,13.11 55.63,13.72 55.63,17.53 IC1.23
  Bottom 0.356: Q1.2 59.11,24.38 59.11,20.8 57.3,20.8 57.3,17 55.63,17 55.63,13.72 v56.24,13.11
  Bottom 0.406: Q1.2 59.83,24.48 | C4.2 63.52,24.38 59.11,24.38
N$2  (via drill 0.51)
  Top 0.406: v56.46,15.54 56.46,17.6 IC1.24
  Bottom 0.406: v56.46,15.54 Q1.1 58.98,15.7 58.98,17.6 60.96,17.6 60.96,19.32 C5.2
N$3  (via drill 0.51)
  Top 0.406: R7.2 1.27,41.53 1.27,53.47 v2.36,54.56
  Bottom 0.406: v2.36,54.56 3.89,56.08 13.29,56.08 U$1.LEDG-
N$4  (via drill 0.51)
  Top 0.406: v11.68,32.89 11.68,34.54 L1.2
  Bottom 0.406: C6.1 v11.68,32.89 14.36,32.89 14.36,44.24 | 14.36,44.24 U$1.2 14.07,48.07 R3.2 | 14.36,44.24 14.65,44.53 R2.2
N$5  (via drill 0.51)
  Top 0.406: v6.99,32.77 5.08,32.77 5.08,28.32 U1.17 | v7.54,40.92 v15.39,40.92
  Bottom 0.406: v6.99,32.77 6.99,40.92 v7.54,40.92 | U$1.1 18.15,47.07 R2.1 18.15,40.92 v15.39,40.92
N$6  (via drill 0.51)
  Top 0.406: v6.22,29.59 U1.16
  Bottom 0.406: v6.22,29.59 9.78,29.59 9.78,34.8 12.8,34.8 U$1.3 12.89,47.16 R3.1
N$7  (via drill 0.51)
  Top 0.406: U1.13 15.39,29.59 15.39,39.24 v11.51,39.24
  Bottom 0.406: R4.1 10.97,50.46 10.97,48.92 11.53,48.36 U$1.4 | U$1.4 11.58,44.53 | v11.51,39.24 11.51,44.53 U$1.4
N$8  (via drill 0.51)
  Top 0.406: U1.12 14.4,28.32 14.4,38.25 v8.99,38.25
  Bottom 0.406: R5.1 5.77,45.8 7.72,45.8 U$1.6 v8.99,38.25
N$9  (via drill 0.51)
  Top 0.406: v10.29,42.29 16.92,42.29 v16.92,39.17
  Bottom 0.406: R5.2 8.59,49.97 R4.2 9.11,48.22 U$1.5 10.26,42.29 v10.29,42.29 | 16.89,35.82 C7.1 v16.92,39.17
N$10  (via drill 0.51)
  Top 0.406: v6.22,15.62 U1.27
  Bottom 0.406: R6.1 1.27,34.61 1.27,15.62 v6.22,15.62
N$11
  Top 0.406: R7.1 1.27,16.89 U1.26
N$12
  Bottom 0.406: R6.2 4.34,42.14 1.29,45.19 1.29,55.24 3.55,57.5 U$1.LEDY-
N$13
  Top 0.406: IC4.3 59.89,49.89 62.23,49.89 62.23,57.02 45.92,57.02 45.92,45.43 G1.P$1
N$14
  Top 0.406: IC4.1 64.97,47.3 Q3.2
N$15
  Top 0.406: IC4.2 65,48.56 Q3.1
N$16  (via drill 0.51)
  Top 0.406: Q2.2 20.07,6.35 v21.84,6.35 | v6.22,20.7 U1.23
  Bottom 0.406: v6.22,20.7 8.4,20.7 8.4,14.35 16.06,14.35 C13.1 20.07,10.54 20.07,6.35 v21.84,6.35
N$17  (via drill 0.51)
  Top 0.406: Q2.1 8.13,6.6 v4.06,6.6 | v6.22,19.43 U1.24
  Bottom 0.406: 7.24,10.54 C14.1 | v6.22,19.43 7.24,19.43 7.24,10.54 | 7.24,10.54 4.06,10.54 v4.06,6.6
N$18
  Top 0.508: R12.2 LED_SD_WP.C
N$19
  Top 0.508: R13.2 LED_SD_DET.C
N$20  (via drill 0.51)
  Top 0.406: 17.3,30.92 U1.14 v19.3,30.86
  Bottom 0.406: R8.2 13.84,30.86 v19.3,30.86
N$21
  Top 0.406: U1.1 17.3,12.06 22.23,12.06 C15.+
N$22
  Top 0.508: R14.2 LED_SD_IO.C
N$31
  Bottom 0.508: D1.A 92.37,46.94 D3.C | D3.C 92.06,47.43 | X2.1 92.37,51.22 D3.C
N$32  (via drill 0.51)
  Top 0.406: IC1.62 52.5,34.88 v52.32,35.05
  Bottom 0.406: v52.32,35.05 52.45,35.05 52.9,34.6 C21.2
N$33
  Bottom 0.508: D2.A D4.C 81.24,51.82 81.24,52.06 81.24,54.22 X2.3 83.56,57.52 X2.2
N$34  (via drill 0.51)
  Top 0.508: v92.71,40.51 92.71,45.72 C16.+ 90.22,45.72 90.22,48.08 85.42,48.08 85.42,50.6 79.83,50.6 C19.1 79.83,52.81 v78.11,52.81
  Bottom 0.508: D2.C D1.C 90.17,43.43 90.17,40.51 v92.71,40.51 | v78.11,52.81 78.11,57.23 76.5,57.23 76.5,63.3 STAB_5V.3
N$35  (via drill 0.51)
  Top 0.406: 50.93,33.2 IC1.64 50.9,33.61 v49.55,34.95
  Bottom 0.406: v49.55,34.95 49.55,32.97 50.7,31.83 50.67,31.83 50.67,28.83 50.39,28.55 C23.2 | 50.67,28.35 50.6,28.27 50.38,28.27 C23.2 | C23.2 50.22,28.55 | C23.2 50.24,26.85 48.54,26.85 L2.2
N$36
  Top 0.508: R9.2 42.55,59.23 LED_PWR.C
PB5  (via drill 0.51)
  Top 0.406: IC1.15 50.42,20.2 50.42,19.05 49.91,18.54 49.91,12.95 52.32,12.95 v52.32,12.32
  Bottom 0.406: v52.32,12.32 52.32,9.96 50.52,8.15 48.13,8.13 EXCONN.13
PB6  (via drill 0.51)
  Top 0.406: IC1.16 49.1,11.99 v49.4,11.68
  Bottom 0.406: EXCONN.16 v49.4,11.68
PB7  (via drill 0.51)
  Top 0.406: IC1.17 50.9,13.82 v52.88,13.82
  Bottom 0.406: EXCONN.15 50.42,6.86 53.34,9.86 53.34,13.36 v52.88,13.82
PD4  (via drill 0.51)
  Top 0.406: IC1.29 60.5,14.18 v60.83,13.84
  Bottom 0.406: v60.83,13.84 60.83,10.67 57.91,10.67 50.93,3.68 42.29,3.68 39.24,6.73 EXCONN.7
PD5  (via drill 0.51)
  Top 0.406: IC1.30 61.3,15.67 v61.72,15.24
  Bottom 0.406: 59.56,9.91 arc90 59.44,9.91 | 59.56,9.91 61.85,9.91 61.85,15.24 v61.72,15.24 | 59.56,9.91 58.29,9.91 51.31,2.92 40.51,2.92 36.7,6.73 EXCONN.5
PD6  (via drill 0.51)
  Top 0.406: IC1.31 62.1,16.9 v62.87,16.13
  Bottom 0.406: v62.87,16.13 62.99,16 62.99,9.14 58.67,9.14 51.69,2.16 38.73,2.16 34.16,6.73 EXCONN.3
PD7  (via drill 0.51)
  Top 0.406: IC1.32 63.43,17.6 v64.26,16.76
  Bottom 0.406: v64.26,16.76 64.26,8.38 59.05,8.38 52.07,1.4 36.96,1.4 31.62,6.73 EXCONN.1
PDI  (via drill 0.51)
  Top 0.406: IC1.2 50.75,30.6 50.75,31.7 48.54,33.91 48.54,52.98 58.6,52.98 v58.62,53.01
  Bottom 0.406: ISP.1 63.98,59.99 63.98,53.01 v58.62,53.01
PDO  (via drill 0.51)
  Top 0.406: IC1.3 47.7,29.8 47.68,54.03 v53.7,54.03
  Bottom 0.406: ISP.9 53.7,60.2 v53.7,54.03
PE4  (via drill 0.51)
  Top 0.406: IC1.6 44.81,27.4 44.81,27.89 39.55,27.89 v39.55,26.9
  Bottom 0.406: v39.55,26.9 39.55,16 44.32,11.23 EXCONN.12
PE5  (via drill 0.51)
  Top 0.406: IC1.7 42.67,26.6 v42.67,26.82
  Bottom 0.406: 46.99,9.4 EXCONN.14 46.86,11.96 42.67,16.15 v42.67,26.82
PF0  (via drill 0.51)
  Top 0.406: IC1.61 53.3,35.48 52.58,36.2 52.58,38.35 v52.96,38.73
  Bottom 0.406: v52.96,38.73 52.96,42.04 PORTF.7
PF1  (via drill 0.51)
  Top 0.406: IC1.60 54.1,38.1 v53.98,38.1
  Bottom 0.406: v53.98,38.1 53.98,40.51 PORTF.8
PF2  (via drill 0.51)
  Top 0.406: IC1.59 54.9,38.64 v55.12,38.86
  Bottom 0.406: v55.12,38.86 55.5,39.24 55.5,42.16 56.64,43.31 PORTF.5
PF3  (via drill 0.51)
  Top 0.406: IC1.58 55.7,38.04 v56.39,38.73
  Bottom 0.406: v56.39,38.73 56.77,39.12 PORTF.6
PF4  (via drill 0.51)
  Top 0.406: IC1.57 56.5,37.57 v57.78,38.86
  Bottom 0.406: v57.78,38.86 58.04,39.12 58.04,42.16 59.18,43.31 PORTF.3
PF5  (via drill 0.51)
  Top 0.406: IC1.56 57.3,36.98 v58.93,38.61
  Bottom 0.406: v58.93,38.61 59.31,38.99 PORTF.4
PF6  (via drill 0.51)
  Top 0.406: IC1.55 58.1,36.51 v60.33,38.73
  Bottom 0.406: v60.33,38.73 60.58,38.99 60.58,42.16 61.72,43.31 PORTF.1
PF7  (via drill 0.51)
  Top 0.406: IC1.54 58.9,36.04 v60.33,37.47
  Bottom 0.406: v60.33,37.47 61.85,37.47 PORTF.2
RD  (via drill 0.51)
  Top 0.406: v72.64,13.08 IC3.24 | v68.83,13.08 68.83,20.19 IC1.34
  Bottom 0.406: v68.83,13.08 v72.64,13.08
RST  (via drill 0.51)
  Top 0.406: v52.96,15.93 arc-90 52.91,15.97 53.3,15.97 IC1.20
  Bottom 0.356: 62.71,31.24 62.71,29.03 55.63,29.03 53.29,29.03 53.29,22.89 49.45,22.89 49.45,20.73
  Bottom 0.406: ISP.5 61.04,62.64 66.45,62.64 66.47,43.56 71.42,43.56 71.7,43.56 | 71.7,43.56 75.44,43.56 75.44,41.25 64.26,41.25 64.26,32.77 62.74,31.24 62.71,31.24 | S1.2 S1.1 71.73,43.59 arc-90 71.7,43.56 | R1.1 47.52,15.93 49.43,15.93 | 49.43,15.93 v52.96,15.93 | C3.1 49.43,21.23 49.43,20.73 | 49.43,15.93 49.43,20.73 | 49.43,20.73 49.45,20.73
RXD  (via drill 0.51)
  Top 0.406: IC1.27 58.93,17.6 58.93,12.29 59.61,11.61 v59.61,7.44
  Bottom 0.406: TTY.2 58.29,6.12 v59.61,7.44
SCK  (via drill 0.51)
  Top 0.406: IC1.11 48.94,23.37 v32.26,23.37 17.43,23.37 arc90 U1.8
  Bottom 0.406: ISP.7 57.17,61.7 56.24,62.64 52.43,62.64 52.4,54.84 34.9,54.84 34.9,43.03 32.26,43.03 U$2.5 v32.26,23.37 32.26,17.88 39.24,10.9 EXCONN.8
SCL  (via drill 0.51)
  Top 0.356: 57.38,14.35 57.38,17.52
  Top 0.406: 57.3,14.37 v57.28,14.35 57.38,14.35 | v41.07,17.75 v44.42,17.75 | v45.64,5.26 45.64,4.57 R11.1 | 57.38,17.52 IC1.25 | v50.72,49.73 53.75,49.73 IC4.6
  Bottom 0.406: v57.28,14.35 57.28,12.45 50.04,5.21 45.57,5.21 v45.64,5.26 45.57,5.26 45.57,6.33 44.86,6.33 EXCONN.11 45.57,8.1 45.57,11.66 41.07,16.15 v41.07,17.75 | v44.42,17.75 44.45,17.75 44.45,27.81 43.69,28.57 43.71,38.46 43.71,40.79 42.42,40.79 42.42,43.97 48.82,43.97 48.82,49.73 v50.72,49.73
SD_DET  (via drill 0.51)
  Top 0.406: IC1.8 37.87,25.8 37.87,27.66 v24.48,27.66 | R13.1 27.43,50.8 33.05,50.8 33.05,38.56 24.38,38.56 v24.38,37.41
  Bottom 0.406: v24.48,27.66 24.38,27.66 v24.38,37.41 U$2.11
SD_WP  (via drill 0.51)
  Top 0.406: IC1.4 46.63,29 46.63,29.64 23.11,29.64 v23.11,29.72 | v23.11,34.91 21.77,34.91 21.77,53.37 23.11,53.37 R12.1
  Bottom 0.406: U$2.10 v23.11,34.91 v23.11,29.72
SDA  (via drill 0.51)
  Top 0.356: v58.17,11.58 58.17,17.53
  Top 0.406: 58.17,17.53 IC1.26 | v42.6,4.72 44.73,2.59 R10.1 | v50.72,51.23 53.75,51.23 IC4.5
  Bottom 0.406: 43.31,5.33 EXCONN.9 43.05,8.13 43.05,10.9 37.8,16.15 37.8,35.18 41.15,35.18 41.15,45.11 47.7,45.11 47.7,51.23 v50.72,51.23 | 43.31,5.33 44.2,4.45 50.42,4.45 57.56,11.58 v58.17,11.58 | v42.6,4.72 43.31,5.33
TXD  (via drill 0.51)
  Top 0.406: IC1.28 59.69,12.7 63.3,12.7 v63.3,7.57
  Bottom 0.406: TTY.3 60.83,7.57 v63.3,7.57
WR
  Top 0.406: IC1.33 67.77,19.4 67.77,6.73 IC3.29

### Text on the board
Top: PWR | SD WP | SD DET | SD IO | AVR-net | rev.B | by PAKO Mar 2012 | Gnd | Rx | Tx | 3v3
Bottom: AVR-net | rev.B | by PAKO Mar 2012